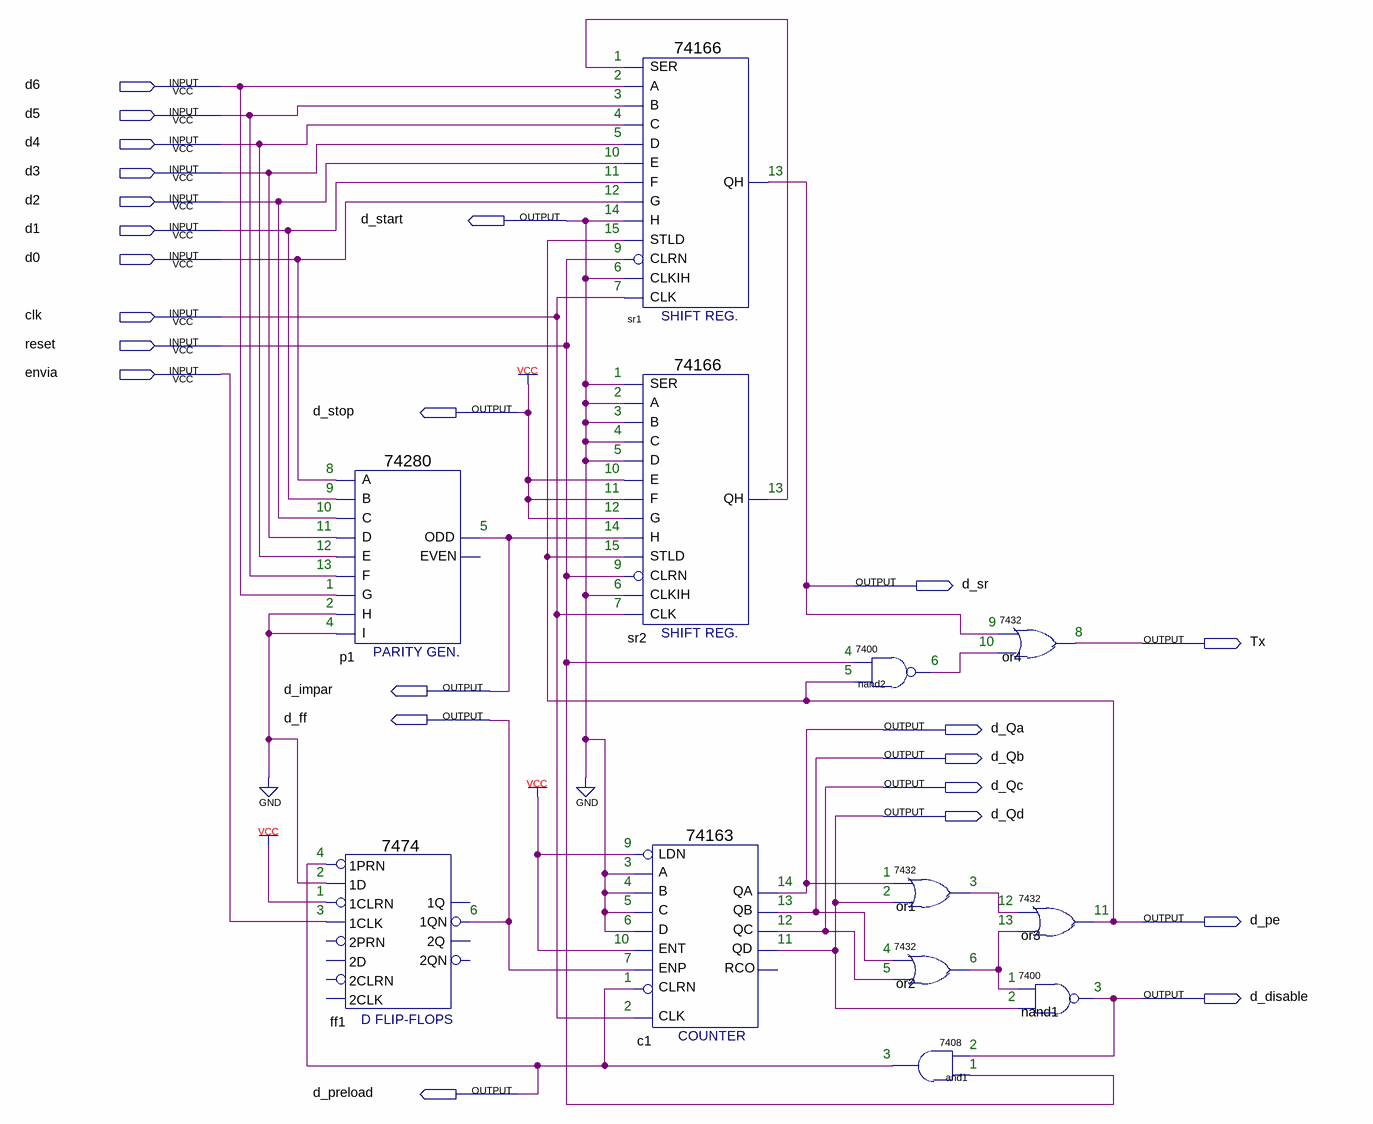
[diagram p0: schematic sheet]
// Quartus schematic p1.bdf as structural Verilog: 12 symbols, 23 pins
module p1 (
  input  d6,
  input  d5,
  input  d4,
  input  d3,
  input  d2,
  input  d1,
  input  d0,
  input  clk,
  input  reset,
  input  envia,
  output d_start,
  output d_stop,
  output d_sr,
  output Tx,
  output d_impar,
  output d_ff,
  output d_Qa,
  output d_Qb,
  output d_Qc,
  output d_Qd,
  output d_pe,
  output d_disable,
  output d_preload
);

  wire nand2_1, or1_1, or2_1, sr2_qh;

  \7474  ff1 (
    .\1CLK (envia), .\1D (1'b0), .\1PRN (d_preload), .\1CLRN (1'b1), .\1QN (d_ff));  // open: 2D, 2PRN, 2CLK, 2CLRN, 2Q, 2QN, 1Q
  \74280  p1 (.B(d1), .A(d0), .F(d5), .E(d4), .D(d3), .I(1'b0), .C(d2), .G(d6), .H(1'b0), .ODD(d_impar));  // open: EVEN
  \74166  sr1 (
    .SER(sr2_qh), .A(d6), .C(d4), .D(d3), .E(d2), .B(d5), .STLD(d_pe), .H(1'b0), .G(d0), .F(d1), .CLK(clk),
    .CLRN(reset), .CLKIH(1'b0), .QH(d_sr));
  \74166  sr2 (
    .SER(1'b0), .A(1'b0), .C(1'b0), .D(1'b0), .E(1'b1), .B(1'b0), .STLD(d_pe), .H(d_impar), .G(1'b1),
    .F(1'b1), .CLK(clk), .CLRN(reset), .CLKIH(1'b0), .QH(sr2_qh));
  \74163  c1 (
    .C(1'b0), .B(1'b0), .A(1'b0), .ENT(1'b1), .D(1'b0), .CLRN(d_preload), .CLK(clk), .ENP(d_ff), .LDN(1'b1),
    .QA(d_Qa), .QB(d_Qb), .QC(d_Qc), .QD(d_Qd));  // open: RCO
  \7400  nand2 (.\3 (d_pe), .\2 (reset), .\1 (nand2_1));
  \7432  or1 (.\2 (d_Qa), .\3 (d_Qd), .\1 (or1_1));
  \7432  or2 (.\2 (d_Qb), .\3 (d_Qc), .\1 (or2_1));
  \7408  and1 (.\3 (reset), .\2 (d_disable), .\1 (d_preload));
  \7432  or4 (.\2 (d_sr), .\3 (nand2_1), .\1 (Tx));
  \7432  or3 (.\2 (or1_1), .\3 (or2_1), .\1 (d_pe));
  \7400  nand1 (.\3 (d_Qd), .\2 (or2_1), .\1 (d_disable));

  assign d_start = 1'b0;
  assign d_stop = 1'b1;

  // Notes on the sheet:
  //   1
  //   2
  //   3
  //   4
  //   5
  //   10
  //   11
  //   13
  //   12
  //   14
  //   15
  //   9
  //   6
  //   7
  //   1
  //   2
  //   3
  //   4
  //   5
  //   8
  //   10
  //   9
  //   11
  //   13
  //   10
  //   12
  //   11
  //   5
  //   14
  //   12
  //   15
  //   13
  //   9
  //   1
  //   6
  //   2
  //   7
  //   4
  //   9
  //   8
  //   10
  //   4
  //   6
  //   5
  //   9
  //   4
  //   3
  //   2
  //   1
  //   4
  //   14
  //   3
  //   1
  //   2
  //   5
  //   13
  //   12
  //   3
  //   6
  //   11
  //   6
  //   12
  //   13
  //   10
  //   11
  //   4
  //   7
  //   6
  //   5
  //   1
  //   1
  //   3
  //   2
  //   2
  //   2
  //   3
  //   1
endmodule
